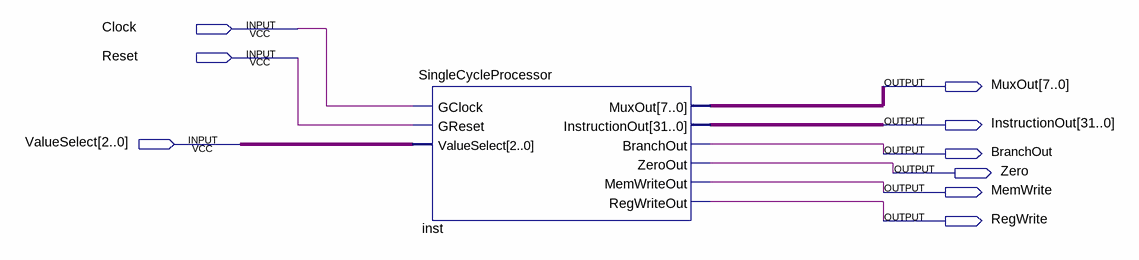
[diagram p0: schematic sheet]
// Quartus schematic SingleCycleProcessor_TOP.bdf as structural Verilog: 1 symbols, 9 pins
module SingleCycleProcessor_TOP (
  input  Clock,
  input  Reset,
  input  [2:0] ValueSelect,
  output [7:0] MuxOut,
  output [31:0] InstructionOut,
  output BranchOut,
  output Zero,
  output MemWrite,
  output RegWrite
);

  SingleCycleProcessor inst (
    .GClock(Clock), .GReset(Reset), .ValueSelect(ValueSelect), .MuxOut(MuxOut),
    .InstructionOut(InstructionOut), .BranchOut(BranchOut), .ZeroOut(Zero), .MemWriteOut(MemWrite),
    .RegWriteOut(RegWrite));
endmodule
